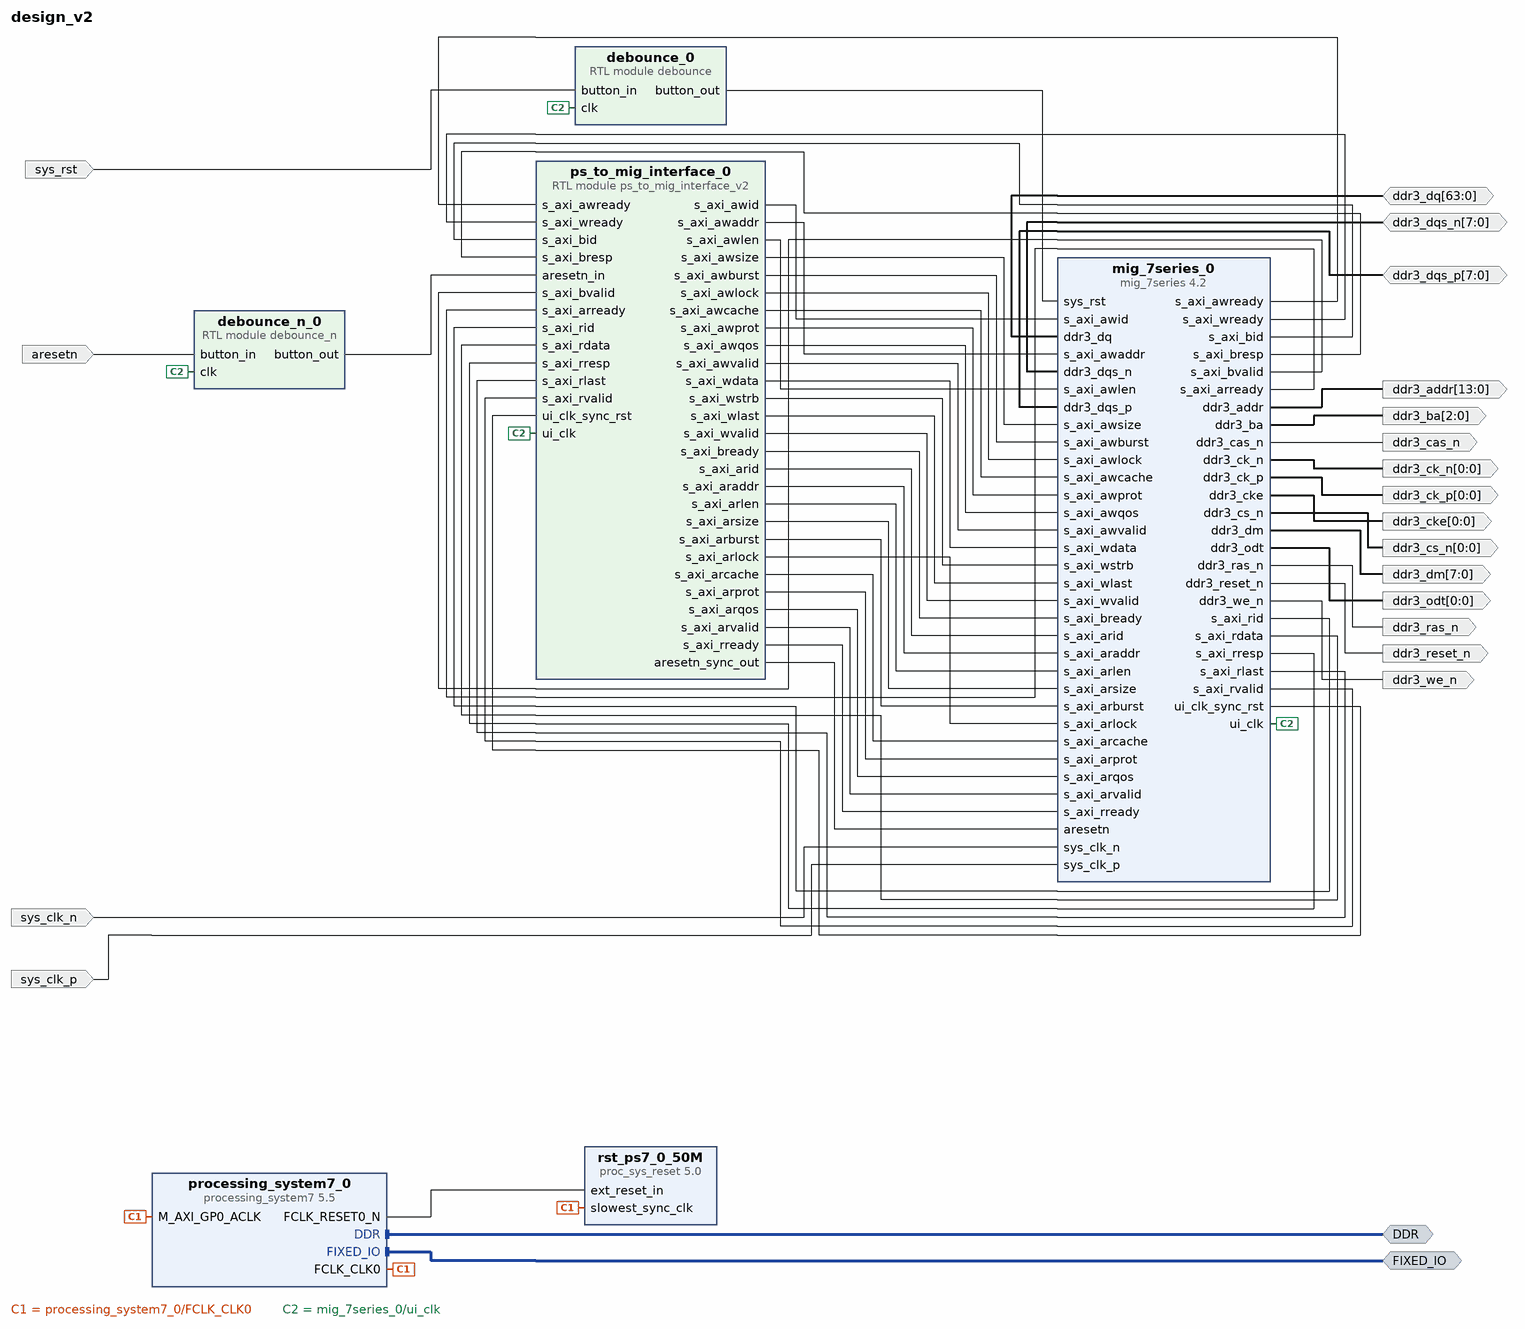
[diagram p0: block diagram of the top level]
# Vivado block design design_v2, xc7z045ffg900-2, Vivado 2020.1
create_bd_design design_v2

create_bd_intf_port -mode Master -vlnv xilinx.com:interface:ddrx_rtl:1.0 DDR
create_bd_intf_port -mode Master -vlnv xilinx.com:display_processing_system7:fixedio_rtl:1.0 FIXED_IO
create_bd_port -dir IO -from 63 -to 0 ddr3_dq
create_bd_port -dir IO -from 7 -to 0 ddr3_dqs_p
create_bd_port -dir IO -from 7 -to 0 ddr3_dqs_n
create_bd_port -dir O -from 13 -to 0 ddr3_addr
create_bd_port -dir O -from 2 -to 0 ddr3_ba
create_bd_port -dir O ddr3_ras_n
create_bd_port -dir O ddr3_cas_n
create_bd_port -dir O ddr3_we_n
create_bd_port -dir O -type rst ddr3_reset_n
create_bd_port -dir O -from 0 -to 0 -type clk ddr3_ck_p
create_bd_port -dir O -from 0 -to 0 -type clk ddr3_ck_n
create_bd_port -dir O -from 0 -to 0 ddr3_cke
create_bd_port -dir O -from 0 -to 0 ddr3_cs_n
create_bd_port -dir O -from 7 -to 0 ddr3_dm
create_bd_port -dir O -from 0 -to 0 ddr3_odt
create_bd_port -dir I aresetn
create_bd_port -dir I sys_rst
create_bd_port -dir I sys_clk_n
create_bd_port -dir I sys_clk_p

create_bd_cell -type ip -vlnv xilinx.com:ip:mig_7series:4.2 mig_7series_0
set_property -dict [list \
  CONFIG.BOARD_MIG_PARAM Custom \
  CONFIG.MIG_DONT_TOUCH_PARAM Custom \
  CONFIG.RESET_BOARD_INTERFACE reset \
  CONFIG.XML_INPUT_FILE mig_a.prj \
] [get_bd_cells mig_7series_0]
create_bd_cell -type ip -vlnv xilinx.com:ip:processing_system7:5.5 processing_system7_0
set_property -dict [list \
  CONFIG.PCW_APU_PERIPHERAL_FREQMHZ 667.000000 \
  CONFIG.PCW_DUAL_PARALLEL_QSPI_DATA_MODE x8 \
  CONFIG.PCW_ENET0_ENET0_IO {MIO 16 .. 27} \
  CONFIG.PCW_ENET0_GRP_MDIO_ENABLE 1 \
  CONFIG.PCW_ENET0_GRP_MDIO_IO {MIO 52 .. 53} \
  CONFIG.PCW_ENET0_PERIPHERAL_ENABLE 1 \
  CONFIG.PCW_ENET0_PERIPHERAL_FREQMHZ {100 Mbps} \
  CONFIG.PCW_ENET0_RESET_ENABLE 1 \
  CONFIG.PCW_ENET0_RESET_IO {MIO 47} \
  CONFIG.PCW_ENET_RESET_ENABLE 1 \
  CONFIG.PCW_ENET_RESET_SELECT {Share reset pin} \
  CONFIG.PCW_GPIO_MIO_GPIO_ENABLE 1 \
  CONFIG.PCW_GPIO_MIO_GPIO_IO MIO \
  CONFIG.PCW_I2C0_GRP_INT_ENABLE 0 \
  CONFIG.PCW_I2C0_I2C0_IO {MIO 50 .. 51} \
  CONFIG.PCW_I2C0_PERIPHERAL_ENABLE 1 \
  CONFIG.PCW_I2C0_RESET_ENABLE 1 \
  CONFIG.PCW_I2C0_RESET_IO {MIO 46} \
  CONFIG.PCW_I2C_PERIPHERAL_FREQMHZ 111.111115 \
  CONFIG.PCW_I2C_RESET_ENABLE 1 \
  CONFIG.PCW_I2C_RESET_SELECT {Share reset pin} \
  CONFIG.PCW_PRESET_BANK0_VOLTAGE {LVCMOS 1.8V} \
  CONFIG.PCW_PRESET_BANK1_VOLTAGE {LVCMOS 1.8V} \
  CONFIG.PCW_QSPI_GRP_FBCLK_ENABLE 1 \
  CONFIG.PCW_QSPI_GRP_FBCLK_IO {MIO 8} \
  CONFIG.PCW_QSPI_GRP_IO1_ENABLE 1 \
  CONFIG.PCW_QSPI_GRP_IO1_IO {MIO 0 9 .. 13} \
  CONFIG.PCW_QSPI_GRP_SINGLE_SS_ENABLE 0 \
  CONFIG.PCW_QSPI_INTERNAL_HIGHADDRESS 0xFDFFFFFF \
  CONFIG.PCW_QSPI_PERIPHERAL_ENABLE 1 \
  CONFIG.PCW_QSPI_QSPI_IO {MIO 1 .. 6} \
  CONFIG.PCW_SD0_GRP_CD_ENABLE 1 \
  CONFIG.PCW_SD0_GRP_CD_IO {MIO 14} \
  CONFIG.PCW_SD0_GRP_WP_ENABLE 1 \
  CONFIG.PCW_SD0_GRP_WP_IO {MIO 15} \
  CONFIG.PCW_SD0_PERIPHERAL_ENABLE 1 \
  CONFIG.PCW_SD0_SD0_IO {MIO 40 .. 45} \
  CONFIG.PCW_SDIO_PERIPHERAL_FREQMHZ 50 \
  CONFIG.PCW_TTC0_PERIPHERAL_ENABLE 1 \
  CONFIG.PCW_TTC0_TTC0_IO EMIO \
  CONFIG.PCW_UART1_PERIPHERAL_ENABLE 1 \
  CONFIG.PCW_UART1_UART1_IO {MIO 48 .. 49} \
  CONFIG.PCW_UART_PERIPHERAL_FREQMHZ 50 \
  CONFIG.PCW_UIPARAM_DDR_FREQ_MHZ 533.333313 \
  CONFIG.PCW_UIPARAM_DDR_PARTNO Custom \
  CONFIG.PCW_USB0_PERIPHERAL_ENABLE 1 \
  CONFIG.PCW_USB0_RESET_ENABLE 1 \
  CONFIG.PCW_USB0_RESET_IO {MIO 7} \
  CONFIG.PCW_USB0_USB0_IO {MIO 28 .. 39} \
  CONFIG.PCW_USB_RESET_ENABLE 1 \
  CONFIG.PCW_USB_RESET_SELECT {Share reset pin} \
  CONFIG.preset ZC706 \
] [get_bd_cells processing_system7_0]
# 234 more settings of processing_system7_0 are not shown: defaults, MIO pin electricals, DDR timing, and values the tool derives
create_bd_cell -type ip -vlnv xilinx.com:ip:proc_sys_reset:5.0 rst_ps7_0_50M
create_bd_cell -type module -reference debounce_n debounce_n_0
create_bd_cell -type module -reference debounce debounce_0
create_bd_cell -type module -reference ps_to_mig_interface_v2 ps_to_mig_interface_0

# ---- connections ----

connect_bd_intf_net [get_bd_intf_ports FIXED_IO] [get_bd_intf_pins processing_system7_0/FIXED_IO]
connect_bd_intf_net [get_bd_intf_ports DDR] [get_bd_intf_pins processing_system7_0/DDR]
connect_bd_net [get_bd_pins processing_system7_0/FCLK_CLK0] \
  [get_bd_pins processing_system7_0/M_AXI_GP0_ACLK] [get_bd_pins rst_ps7_0_50M/slowest_sync_clk]
connect_bd_net [get_bd_pins processing_system7_0/FCLK_RESET0_N] [get_bd_pins rst_ps7_0_50M/ext_reset_in]
connect_bd_net [get_bd_ports ddr3_dq] [get_bd_pins mig_7series_0/ddr3_dq]
connect_bd_net [get_bd_ports ddr3_dqs_p] [get_bd_pins mig_7series_0/ddr3_dqs_p]
connect_bd_net [get_bd_ports ddr3_dqs_n] [get_bd_pins mig_7series_0/ddr3_dqs_n]
connect_bd_net [get_bd_pins mig_7series_0/ddr3_addr] [get_bd_ports ddr3_addr]
connect_bd_net [get_bd_pins mig_7series_0/ddr3_ba] [get_bd_ports ddr3_ba]
connect_bd_net [get_bd_pins mig_7series_0/ddr3_ras_n] [get_bd_ports ddr3_ras_n]
connect_bd_net [get_bd_pins mig_7series_0/ddr3_cas_n] [get_bd_ports ddr3_cas_n]
connect_bd_net [get_bd_pins mig_7series_0/ddr3_we_n] [get_bd_ports ddr3_we_n]
connect_bd_net [get_bd_pins mig_7series_0/ddr3_reset_n] [get_bd_ports ddr3_reset_n]
connect_bd_net [get_bd_pins mig_7series_0/ddr3_ck_p] [get_bd_ports ddr3_ck_p]
connect_bd_net [get_bd_pins mig_7series_0/ddr3_ck_n] [get_bd_ports ddr3_ck_n]
connect_bd_net [get_bd_pins mig_7series_0/ddr3_cke] [get_bd_ports ddr3_cke]
connect_bd_net [get_bd_pins mig_7series_0/ddr3_cs_n] [get_bd_ports ddr3_cs_n]
connect_bd_net [get_bd_pins mig_7series_0/ddr3_dm] [get_bd_ports ddr3_dm]
connect_bd_net [get_bd_pins mig_7series_0/ddr3_odt] [get_bd_ports ddr3_odt]
connect_bd_net [get_bd_pins ps_to_mig_interface_0/s_axi_awid] [get_bd_pins mig_7series_0/s_axi_awid]
connect_bd_net [get_bd_pins ps_to_mig_interface_0/s_axi_awaddr] [get_bd_pins mig_7series_0/s_axi_awaddr]
connect_bd_net [get_bd_pins ps_to_mig_interface_0/s_axi_awlen] [get_bd_pins mig_7series_0/s_axi_awlen]
connect_bd_net [get_bd_pins ps_to_mig_interface_0/s_axi_awsize] [get_bd_pins mig_7series_0/s_axi_awsize]
connect_bd_net [get_bd_pins ps_to_mig_interface_0/s_axi_awburst] [get_bd_pins mig_7series_0/s_axi_awburst]
connect_bd_net [get_bd_pins ps_to_mig_interface_0/s_axi_awlock] [get_bd_pins mig_7series_0/s_axi_awlock]
connect_bd_net [get_bd_pins ps_to_mig_interface_0/s_axi_awcache] [get_bd_pins mig_7series_0/s_axi_awcache]
connect_bd_net [get_bd_pins ps_to_mig_interface_0/s_axi_awprot] [get_bd_pins mig_7series_0/s_axi_awprot]
connect_bd_net [get_bd_pins ps_to_mig_interface_0/s_axi_awqos] [get_bd_pins mig_7series_0/s_axi_awqos]
connect_bd_net [get_bd_pins ps_to_mig_interface_0/s_axi_awvalid] [get_bd_pins mig_7series_0/s_axi_awvalid]
connect_bd_net [get_bd_pins mig_7series_0/s_axi_awready] [get_bd_pins ps_to_mig_interface_0/s_axi_awready]
connect_bd_net [get_bd_pins ps_to_mig_interface_0/s_axi_wdata] [get_bd_pins mig_7series_0/s_axi_wdata]
connect_bd_net [get_bd_pins ps_to_mig_interface_0/s_axi_wstrb] [get_bd_pins mig_7series_0/s_axi_wstrb]
connect_bd_net [get_bd_pins ps_to_mig_interface_0/s_axi_wlast] [get_bd_pins mig_7series_0/s_axi_wlast]
connect_bd_net [get_bd_pins ps_to_mig_interface_0/s_axi_wvalid] [get_bd_pins mig_7series_0/s_axi_wvalid]
connect_bd_net [get_bd_pins mig_7series_0/s_axi_wready] [get_bd_pins ps_to_mig_interface_0/s_axi_wready]
connect_bd_net [get_bd_pins mig_7series_0/s_axi_bid] [get_bd_pins ps_to_mig_interface_0/s_axi_bid]
connect_bd_net [get_bd_pins mig_7series_0/s_axi_bresp] [get_bd_pins ps_to_mig_interface_0/s_axi_bresp]
connect_bd_net [get_bd_pins mig_7series_0/s_axi_bvalid] [get_bd_pins ps_to_mig_interface_0/s_axi_bvalid]
connect_bd_net [get_bd_pins ps_to_mig_interface_0/s_axi_bready] [get_bd_pins mig_7series_0/s_axi_bready]
connect_bd_net [get_bd_pins ps_to_mig_interface_0/s_axi_arid] [get_bd_pins mig_7series_0/s_axi_arid]
connect_bd_net [get_bd_pins ps_to_mig_interface_0/s_axi_araddr] [get_bd_pins mig_7series_0/s_axi_araddr]
connect_bd_net [get_bd_pins ps_to_mig_interface_0/s_axi_arlen] [get_bd_pins mig_7series_0/s_axi_arlen]
connect_bd_net [get_bd_pins ps_to_mig_interface_0/s_axi_arsize] [get_bd_pins mig_7series_0/s_axi_arsize]
connect_bd_net [get_bd_pins ps_to_mig_interface_0/s_axi_arburst] [get_bd_pins mig_7series_0/s_axi_arburst]
connect_bd_net [get_bd_pins ps_to_mig_interface_0/s_axi_arlock] [get_bd_pins mig_7series_0/s_axi_arlock]
connect_bd_net [get_bd_pins ps_to_mig_interface_0/s_axi_arcache] [get_bd_pins mig_7series_0/s_axi_arcache]
connect_bd_net [get_bd_pins ps_to_mig_interface_0/s_axi_arprot] [get_bd_pins mig_7series_0/s_axi_arprot]
connect_bd_net [get_bd_pins ps_to_mig_interface_0/s_axi_arqos] [get_bd_pins mig_7series_0/s_axi_arqos]
connect_bd_net [get_bd_pins ps_to_mig_interface_0/s_axi_arvalid] [get_bd_pins mig_7series_0/s_axi_arvalid]
connect_bd_net [get_bd_pins mig_7series_0/s_axi_arready] [get_bd_pins ps_to_mig_interface_0/s_axi_arready]
connect_bd_net [get_bd_pins mig_7series_0/s_axi_rid] [get_bd_pins ps_to_mig_interface_0/s_axi_rid]
connect_bd_net [get_bd_pins mig_7series_0/s_axi_rdata] [get_bd_pins ps_to_mig_interface_0/s_axi_rdata]
connect_bd_net [get_bd_pins mig_7series_0/s_axi_rresp] [get_bd_pins ps_to_mig_interface_0/s_axi_rresp]
connect_bd_net [get_bd_pins mig_7series_0/s_axi_rlast] [get_bd_pins ps_to_mig_interface_0/s_axi_rlast]
connect_bd_net [get_bd_pins mig_7series_0/s_axi_rvalid] [get_bd_pins ps_to_mig_interface_0/s_axi_rvalid]
connect_bd_net [get_bd_pins ps_to_mig_interface_0/s_axi_rready] [get_bd_pins mig_7series_0/s_axi_rready]
connect_bd_net [get_bd_ports sys_clk_n] [get_bd_pins mig_7series_0/sys_clk_n]
connect_bd_net [get_bd_ports sys_clk_p] [get_bd_pins mig_7series_0/sys_clk_p]
connect_bd_net [get_bd_ports aresetn] [get_bd_pins debounce_n_0/button_in]
connect_bd_net [get_bd_pins mig_7series_0/ui_clk] \
  [get_bd_pins debounce_n_0/clk] [get_bd_pins debounce_0/clk] [get_bd_pins ps_to_mig_interface_0/ui_clk]
connect_bd_net [get_bd_ports sys_rst] [get_bd_pins debounce_0/button_in]
connect_bd_net [get_bd_pins debounce_0/button_out] [get_bd_pins mig_7series_0/sys_rst]
connect_bd_net [get_bd_pins debounce_n_0/button_out] [get_bd_pins ps_to_mig_interface_0/aresetn_in]
connect_bd_net [get_bd_pins ps_to_mig_interface_0/aresetn_sync_out] [get_bd_pins mig_7series_0/aresetn]
connect_bd_net [get_bd_pins mig_7series_0/ui_clk_sync_rst] [get_bd_pins ps_to_mig_interface_0/ui_clk_sync_rst]

validate_bd_design
save_bd_design
